# Altium project cc1200_wisun_st.PrjPcb
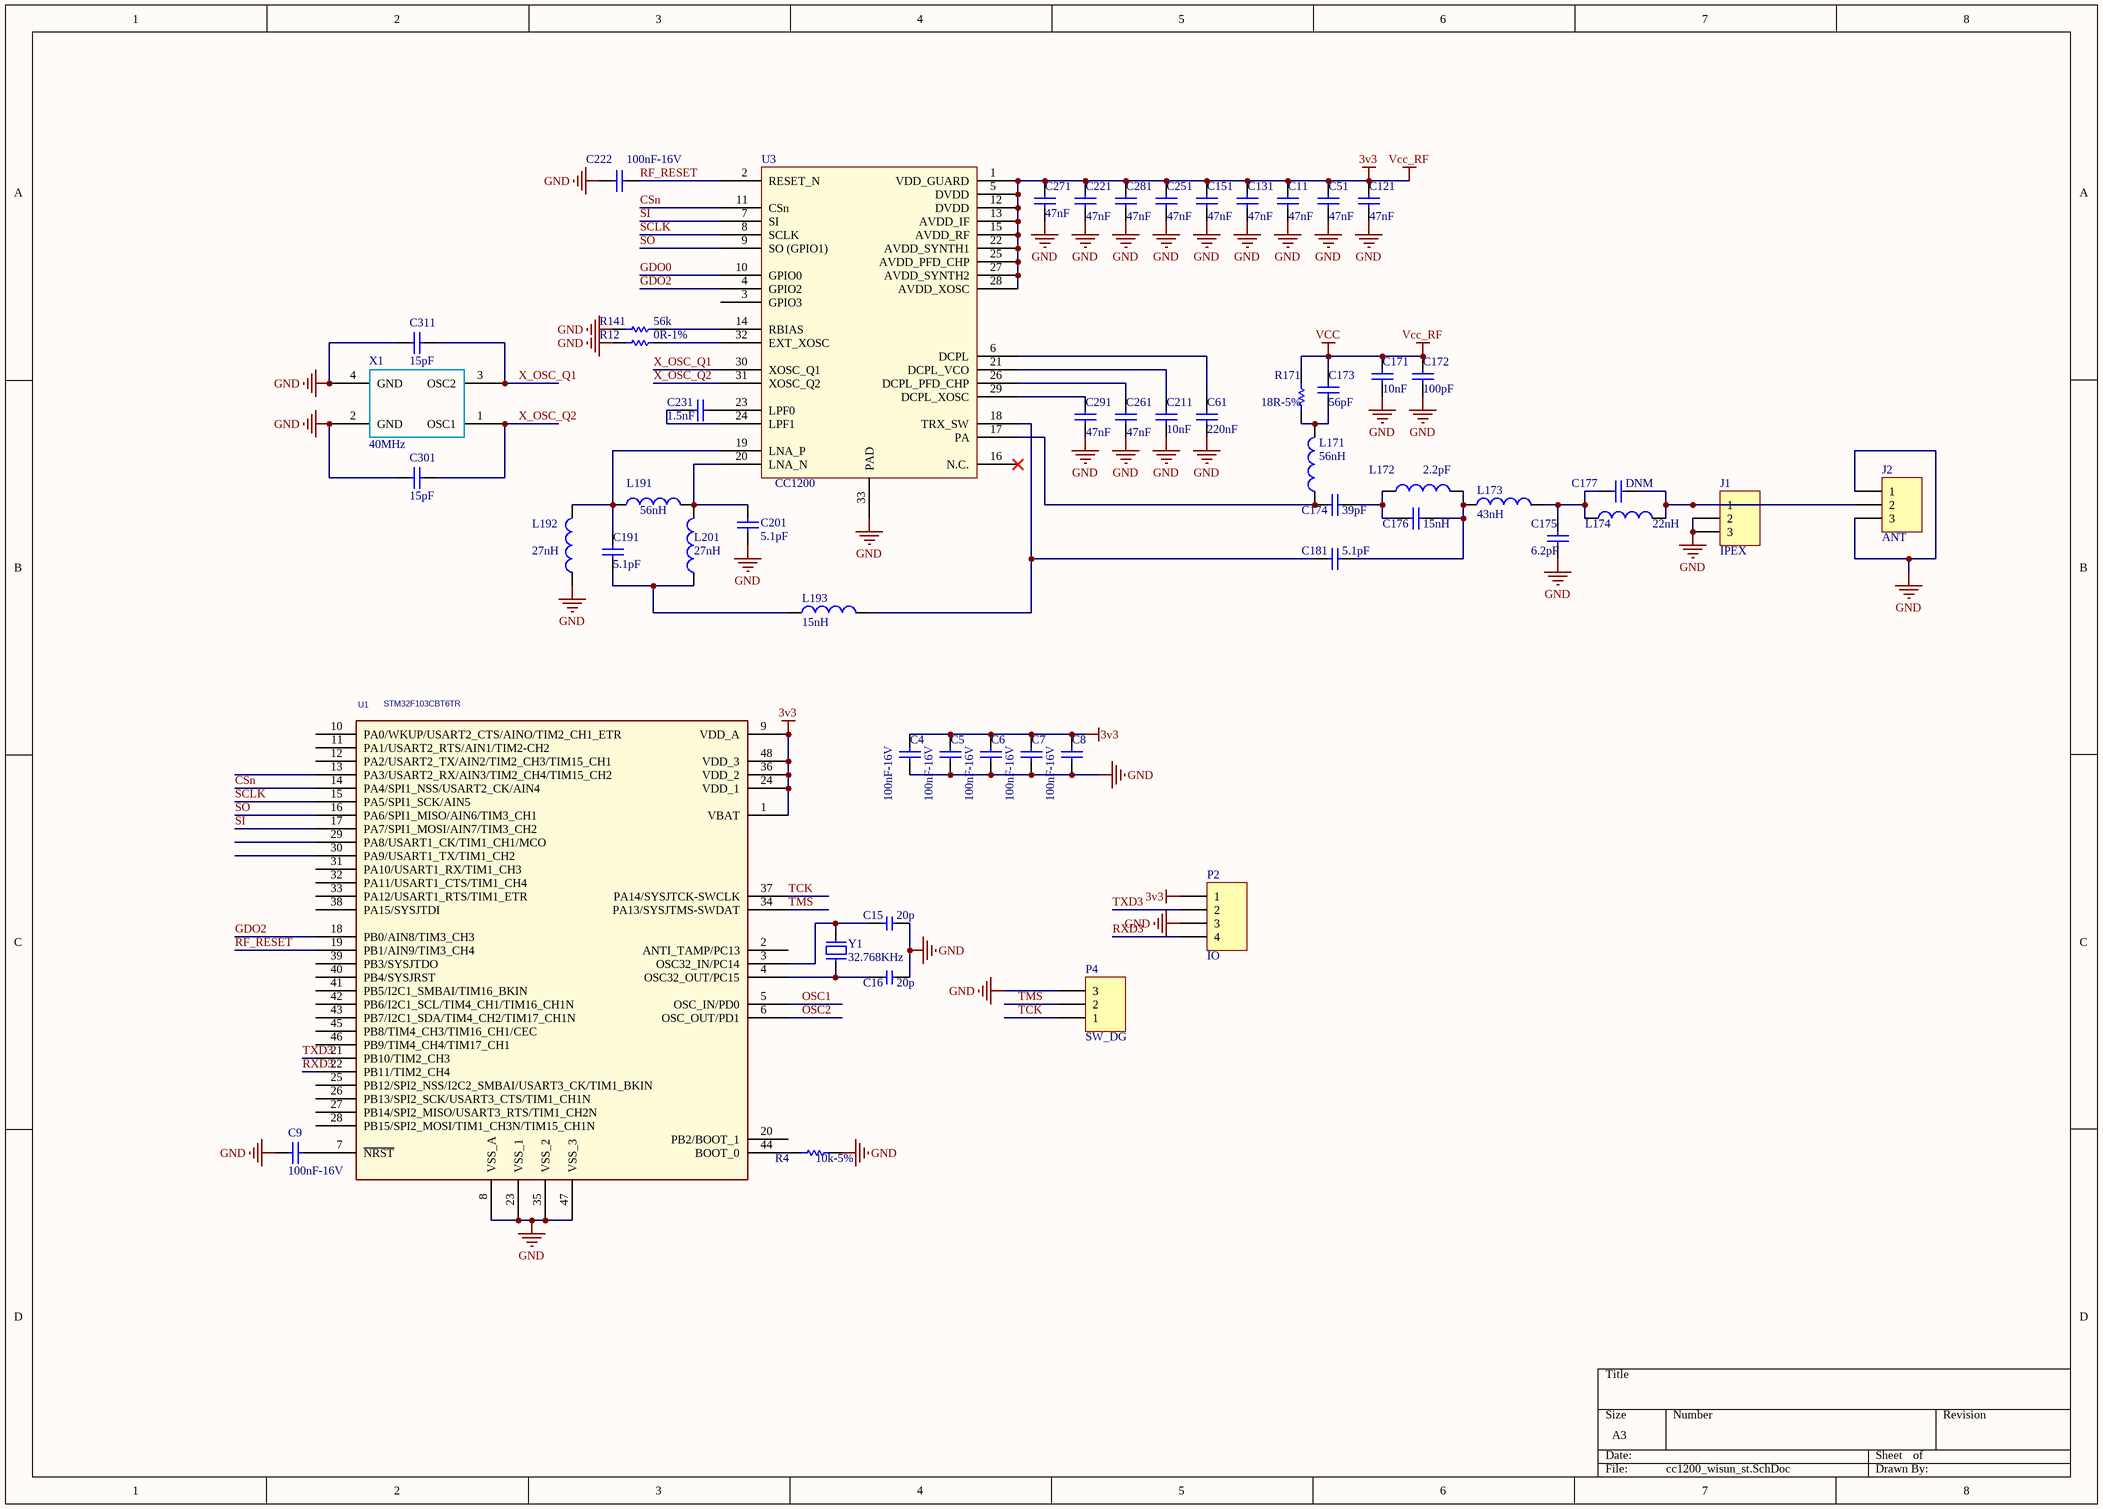
[diagram p0: cc1200_wisun_st.SchDoc]
1 sheet, 55 parts. Net scope: global (net labels, ports and power ports of the same name join across sheets).
Board file: CC1200_wisun_st.PcbDoc

## Sheet cc1200_wisun_st.SchDoc
size A3

### Parts
C4  100nF-16V  [C0402 - SMT - Rounded]
C5  100nF-16V  [C0402 - SMT - Rounded]
C6  100nF-16V  [C0402 - SMT - Rounded]
C7  100nF-16V  [C0402 - SMT - Rounded]
C8  100nF-16V  [C0402 - SMT - Rounded]
C9  100nF-16V  [C0402 - SMT - Rounded]
C11  47nF  [C0402 - SMT - Rounded]
C15  20p  [C0402 - SMT - Rounded]
C16  20p  [C0402 - SMT - Rounded]
C51  47nF  [C0402 - SMT - Rounded]
C61  220nF  [C0402 - SMT - Rounded]
C121  47nF  [C0402 - SMT - Rounded]
C131  47nF  [C0402 - SMT - Rounded]
C151  47nF  [C0402 - SMT - Rounded]
C171  10nF  [C0402 - SMT - Rounded]
C172  100pF  [C0402 - SMT - Rounded]
C173  56pF  [C0402 - SMT - Rounded]
C174  39pF  [C0402 - SMT - Rounded]
C175  6.2pF  [C0402 - SMT - Rounded]
C176  2.2pF  [C0402 - SMT - Rounded]
C177  DNM  [C0402 - SMT - Rounded]
C181  5.1pF  [C0402 - SMT - Rounded]
C191  5.1pF  [C0402 - SMT - Rounded]
C201  5.1pF  [C0402 - SMT - Rounded]
C211  10nF  [C0402 - SMT - Rounded]
C221  47nF  [C0402 - SMT - Rounded]
C222  100nF-16V  [C0402 - SMT - Rounded]
C231  1.5nF  [C0402 - SMT - Rounded]
C251  47nF  [C0402 - SMT - Rounded]
C261  47nF  [C0402 - SMT - Rounded]
C271  47nF  [C0402 - SMT - Rounded]
C281  47nF  [C0402 - SMT - Rounded]
C291  47nF  [C0402 - SMT - Rounded]
C301  15pF  [C0402 - SMT - Rounded]
C311  15pF  [C0402 - SMT - Rounded]
J1  IPEX  [IPEX]
J2  ANT  [ANT]
L171  56nH  [L0402 - SMT - Rounded]
L172  15nH  [L0402 - SMT - Rounded]
L173  43nH  [L0402 - SMT - Rounded]
L174  22nH  [L0402 - SMT - Rounded]
L191  56nH  [L0402 - SMT - Rounded]
L192  27nH  [L0402 - SMT - Rounded]
L193  15nH  [L0402 - SMT - Rounded]
L201  27nH  [L0402 - SMT - Rounded]
P2  IO  [HDR1X4]
P4  SW_DG  [HDR1X3]
R4  10k-5%  [R0402 - SMT - Rounded]
R12  0R-1%  [R0402 - SMT - Rounded]
R141  56k  [R0402 - SMT - Rounded]
R171  18R-5%  [R0402 - SMT - Rounded]
U1  STM32F103CBT6TR  [TQFP-48-P0.5]
U3  CC1200  [QFN-32M]
X1  40MHz  [CRYSTAL-2.5x2-4]
Y1  32.768KHz  [Crystal-3.2x1.5]

### Nets
3v3: C4.2 C5.2 C6.2 C7.2 C8.2 C11.2 C51.2 C121.2 C131.2 C151.2 C171.2 C172.2 C173.2 C221.2 C251.2 C271.2 C281.2 P2.1 R171.2 U1.1(VBAT) U1.9(VDD_A) U1.24(VDD_1) U1.36(VDD_2) U1.48(VDD_3) U3.1(VDD_GUARD) U3.5(DVDD) U3.12(DVDD) U3.13(AVDD_IF) U3.15(AVDD_RF) U3.22(AVDD_SYNTH1) U3.25(AVDD_PFD_CHP) U3.27(AVDD_SYNTH2) U3.28(AVDD_XOSC)  [also labelled VCC, Vcc_RF]
GND: C4.1 C5.1 C6.1 C7.1 C8.1 C9.2 C11.1 C15.1 C16.1 C51.1 C61.1 C121.1 C131.1 C151.1 C171.1 C172.1 C175.2 C201.1 C211.1 C221.1 C222.1 C251.1 C261.1 C271.1 C281.1 C291.1 C301.2 C311.2 J1.2 J1.3 J2.1 J2.3 L192.1 P2.3 P4.3 R4.1 R12.1 R141.2 U1.8(VSS_A) U1.23(VSS_1) U1.35(VSS_2) U1.47(VSS_3) U3.33(PAD) X1.2(GND) X1.4(GND)
CSn: U1.14(PA4/SPI1_NSS/USART2_CK/AIN4) U3.11(CSn)
GDO0: U3.10(GPIO0)
GDO2: U1.18(PB0/AIN8/TIM3_CH3) U3.4(GPIO2)
OSC1: U1.5(OSC_IN/PD0)
OSC2: U1.6(OSC_OUT/PD1)
RF_RESET: C222.2 U1.19(PB1/AIN9/TIM3_CH4) U3.2(RESET_N)
RXD3: P2.4 U1.22(PB11/TIM2_CH4)
SCLK: U1.15(PA5/SPI1_SCK/AIN5) U3.8(SCLK)
SI: U1.17(PA7/SPI1_MOSI/AIN7/TIM3_CH2) U3.7(SI)
SO: U1.16(PA6/SPI1_MISO/AIN6/TIM3_CH1) U3.9(SO_(GPIO1))
TCK: P4.1 U1.37(PA14/SYSJTCK-SWCLK)
TMS: P4.2 U1.34(PA13/SYSJTMS-SWDAT)
TXD3: P2.2 U1.21(PB10/TIM2_CH3)
X_OSC_Q1: C311.1 U3.30(XOSC_Q1) X1.3(OSC2)
X_OSC_Q2: C301.1 U3.31(XOSC_Q2) X1.1(OSC1)
NetC9_1: C9.1 U1.7(~{NRST})
NetC15_2: C15.2 U1.3(OSC32_IN/PC14) Y1.2
NetC16_2: C16.2 U1.4(OSC32_OUT/PC15) Y1.1
NetC61_2: C61.2 U3.6(DCPL)
NetC173_1: C173.1 L171.2 R171.1
NetC174_1: C174.1 C176.2 L172.1
NetC174_2: C174.2 L171.1 U3.17(PA)
NetC175_1: C175.1 C177.2 L173.2 L174.1
NetC176_1: C176.1 C181.1 L172.2 L173.1
NetC177_1: C177.1 J1.1 J2.2 L174.2
NetC181_2: C181.2 L193.2 U3.18(TRX_SW)
NetC191_1: C191.1 L193.1 L201.1
NetC191_2: C191.2 L191.1 L192.2 U3.19(LNA_P)
NetC201_2: C201.2 L191.2 L201.2 U3.20(LNA_N)
NetC211_2: C211.2 U3.21(DCPL_VCO)
NetC231_1: C231.1 U3.24(LPF1)
NetC231_2: C231.2 U3.23(LPF0)
NetC261_2: C261.2 U3.26(DCPL_PFD_CHP)
NetC291_2: C291.2 U3.29(DCPL_XOSC)
NetR4_2: R4.2 U1.44(BOOT_0)
NetR12_2: R12.2 U3.32(EXT_XOSC)
NetR141_1: R141.1 U3.14(RBIAS)

Not connected (* = marked no-connect by the designer): U1 2(ANTI_TAMP/PC13) 10(PA0/WKUP/USART2_CTS/AINO/TIM2_CH1_ETR) 11(PA1/USART2_RTS/AIN1/TIM2-CH2) 12(PA2/USART2_TX/AIN2/TIM2_CH3/TIM15_CH1) 13(PA3/USART2_RX/AIN3/TIM2_CH4/TIM15_CH2) 20(PB2/BOOT_1) 25(PB12/SPI2_NSS/I2C2_SMBAI/USART3_CK/TIM1_BKIN) 26(PB13/SPI2_SCK/USART3_CTS/TIM1_CH1N) 27(PB14/SPI2_MISO/USART3_RTS/TIM1_CH2N) 28(PB15/SPI2_MOSI/TIM1_CH3N/TIM15_CH1N) 29(PA8/USART1_CK/TIM1_CH1/MCO) 30(PA9/USART1_TX/TIM1_CH2) 31(PA10/USART1_RX/TIM1_CH3) 32(PA11/USART1_CTS/TIM1_CH4) 33(PA12/USART1_RTS/TIM1_ETR) 38(PA15/SYSJTDI) 39(PB3/SYSJTDO) 40(PB4/SYSJRST) 41(PB5/I2C1_SMBAI/TIM16_BKIN) 42(PB6/I2C1_SCL/TIM4_CH1/TIM16_CH1N) 43(PB7/I2C1_SDA/TIM4_CH2/TIM17_CH1N) 45(PB8/TIM4_CH3/TIM16_CH1/CEC) 46(PB9/TIM4_CH4/TIM17_CH1); U3 3(GPIO3) 16(N.C.)*

### Library data of the parts
C4-C9 C222 = 100nF-16V-C0402: CAP CER 0.1UF 16V Y5V 0402; Manufacturer: Yageo; Manufacturer Part Number: CC0402ZRY5V7BB104; Digi-Key Part Number: 311-1047-2-ND; Unit Price: 0.0021
C11 C51 C121 C131 C151 C221 C251 C261 C271 C281 C291 = 0.047µF-16V-C0402-10%: CAP CER 0.047UF 16V 10% X7R 0402; Manufacturer: Yageo; Manufacturer Part Number: CC0402KRX7R7BB473; Digi-Key Part Number: 311-1362-2-ND; Unit Price: 0.00370
C15 C16 = C_Dup1: PSpiceTemplate: C^@REFDES %1 %2 ?TOLERANCE|C^@REFDES| @VALUE ?IC/IC=@IC/ ?TOLERANCE|\n.model C^@REFDES CAP C=1 DEV=@TOLERANCE%|; Value: 20p
C61 = 0.22µF-10V-C0402-10%: CAP CER 0.22UF 10V 10% X5R 0402; Manufacturer: Yageo; Manufacturer Part Number: CC0402KRX5R6BB224; Digi-Key Part Number: 311-1421-2-ND; Unit Price: 0.01573
C171 = 5.0pF-50V-C0402-0.25pF: CAP CER 10000PF 25V X7R 0402; Manufacturer: Murata Electronics North America; Manufacturer Part Number: GRM155R71E103KA01D; Digi-Key Part Number: 490-1312-2-ND; Unit Price: 0.00216
C172 = 5.0pF-50V-C0402-0.25pF: CAP CER 100PF 50V NP0 0402; Manufacturer: Murata Electronics North America; Manufacturer Part Number: GRM1555C1H101JA01D; Digi-Key Part Number: 490-5922-2-ND; Unit Price: 0.00483
C173 = 5.0pF-50V-C0402-0.25pF: CAP CER 56PF 50V NP0 0402; Manufacturer: Murata Electronics North America; Manufacturer Part Number: GRM1555C1H560JA01D; Digi-Key Part Number: 490-1288-2-ND; Unit Price: 0.00483
C174 = 5.0pF-50V-C0402-0.25pF: CAP CER 39PF 50V NP0 0402; Manufacturer: Murata Electronics North America; Manufacturer Part Number: GRM1555C1H390JA01D; Digi-Key Part Number: 490-5871-2-ND; Unit Price: 0.00368
C175 = 5.0pF-50V-C0402-0.25pF: CAP CER 6.2PF 50V NP0 0402; Manufacturer: Murata Electronics North America; Manufacturer Part Number: GRM1555C1H6R2CA01D; Digi-Key Part Number: 490-11401-2-ND; Unit Price: 0.00483
C176 = 5.0pF-50V-C0402-0.25pF: CAP CER 2.2PF 50V NP0 0402; Manufacturer: Murata Electronics North America; Manufacturer Part Number: GRM1555C1H2R2CA01D; Digi-Key Part Number: 490-5932-2-ND; Unit Price: 0.00298
C177 = 5.0pF-50V-C0402-0.25pF: CAP CER 1500PF 10V U2J 0402; Manufacturer: Murata Electronics North America; Manufacturer Part Number: GRM1557U1A152JA01D; Digi-Key Part Number: 490-10690-2-ND; Unit Price: 0.02360
C181 C191 C201 = 5.0pF-50V-C0402-0.25pF: CAP CER 5.1PF 50V NP0 0402; Manufacturer: Murata Electronics North America; Manufacturer Part Number: GRM1555C1H5R1CA01D; Digi-Key Part Number: 490-8216-2-ND; Unit Price: 0.00483
C211 = 10nF-16V-C0402-10%: CAP CER 10000PF 16V 10% X7R 0402; Manufacturer: Yageo; Manufacturer Part Number: CC0402KRX7R7BB103; Digi-Key Part Number: 311-1042-2-ND; Unit Price: 0.00216
C231 = 1500pF-50V-C0402-10%: CAP CER 1500PF 50V 10% X7R 0402; Manufacturer: Yageo; Manufacturer Part Number: CC0402KRX7R9BB152; Digi-Key Part Number: 311-1032-2-ND; Unit Price: 0.00302
C301 C311 = 15pF-50V-C0402-5%: CAP CER 15PF 50V NP0 0402; Manufacturer: Murata Electronics North America; Manufacturer Part Number: GRM1555C1H150JA01D; Digi-Key Part Number: 490-5888-2-ND; Unit Price: 0.00227
J1 J2 P4 = Header 3: Header, 3-Pin; LatestRevisionDate: 17-Jul-2002; LatestRevisionNote: Re-released for DXP Platform.; Publisher: Altium Limited
L171 L191 = 8.2nH-500mA-0402: FIXED IND 56NH 200MA 1.17 OHM; Manufacturer: Murata Electronics North America; Manufacturer Part Number: LQW15AN56NJ00D; Digi-Key Part Number: 490-1155-2-ND; Unit Price: 0.04800
L172 L193 = 8.2nH-500mA-0402: FIXED IND 15NH 460MA 160 MOHM; Manufacturer: Murata Electronics North America; Manufacturer Part Number: LQW15AN15NJ00D; Digi-Key Part Number: 490-1148-2-ND; Unit Price: 0.04800
L173 = 8.2nH-500mA-0402: FIXED IND 43NH 250MA 700 MOHM; Manufacturer: Murata Electronics North America; Manufacturer Part Number: LQW15AN43NJ00D; Digi-Key Part Number: 490-6818-2-ND; Unit Price: 0.04800
L174 = 8.2nH-500mA-0402: FIXED IND 22NH 310MA 300 MOHM; Manufacturer: Murata Electronics North America; Manufacturer Part Number: LQW15AN22NJ00D; Digi-Key Part Number: 490-1150-2-ND; Unit Price: 0.04800
L192 L201 = 8.2nH-500mA-0402: FIXED IND 27NH 280MA 520 MOHM; Manufacturer: Murata Electronics North America; Manufacturer Part Number: LQW15AN27NJ00D; Digi-Key Part Number: 490-1151-2-ND; Unit Price: 0.04800
P2 = Header 4: Header, 4-Pin; LatestRevisionDate: 17-Jul-2002; LatestRevisionNote: Re-released for DXP Platform.; Publisher: Altium Limited
R4 = Res1: RES 10K OHM 1/16W 5% 0402 SMD; Manufacturer: Yageo; Manufacturer Part Number: RC0402JR-0710KL; Published: 8-Jun-2000; LatestRevisionDate: 17-Jul-2002; LatestRevisionNote: Re-released for DXP Platform.; PackageReference: R0603; Publisher: Altium Limited; Value: 10k-5%; Digi-Key Part Number: 311-10KJRCT-ND; Unit Price: 0.00178
R12 = 0.1R-1%-R0402: RES .10 OHM 1/16W 1% 0402 SMD; Manufacturer: Yageo; Manufacturer Part Number: RL0402FR-070R1L; Digi-Key Part Number: 311-.10PTR-ND; Unit Price: 0.11022
R141 = Res1: RES SMD 56K OHM 1% 1/16W 0402; Manufacturer: Yageo; Manufacturer Part Number: RC0402FR-0756KL; Digi-Key Part Number: 311-56.0KLRTR-ND
R171 = 18R-5%-R0402: RES 18 OHM 1/16W 5% 0402 SMD; Manufacturer: Yageo; Manufacturer Part Number: RC0402JR-0718RL; Digi-Key Part Number: 311-18JRTR-ND; Unit Price: 0.00130
U1 = ATmega128_4: MCU ARM 128K FLASH/TIMER; Manufacturer: STMicroelectronics; Digi-Key Part Number: 497-6288-ND; Manufacturer Part Number: STM32F103CBT6TR; Unit Price: 2
U3 = CC1200: Des: CC1200 Low-Power, High-Performance RF Transceiver; Property: IC; Ordering: CC1200RHBR; Muf: TI/USA; Price: *
X1 = ZTA Crystal Resonator: 40MHz ±10ppm Crystal 10pF 50 Ohm -40°C ~ 85°C Surface Mount 4-SMD, No Lead (DFN, LCC); Manufacturer: NDK; Manufacturer Part Number: NX3225SA-40M-EXS00A-CS03880; Digi-Key Part Number: 644-1249-2-ND; Unit Price: 0.2
Y1 = XT32.768: Crystal 32.768KHz; Value: 32.768KHz